# EAGLE design calculator (EAGLE 9.6.2)
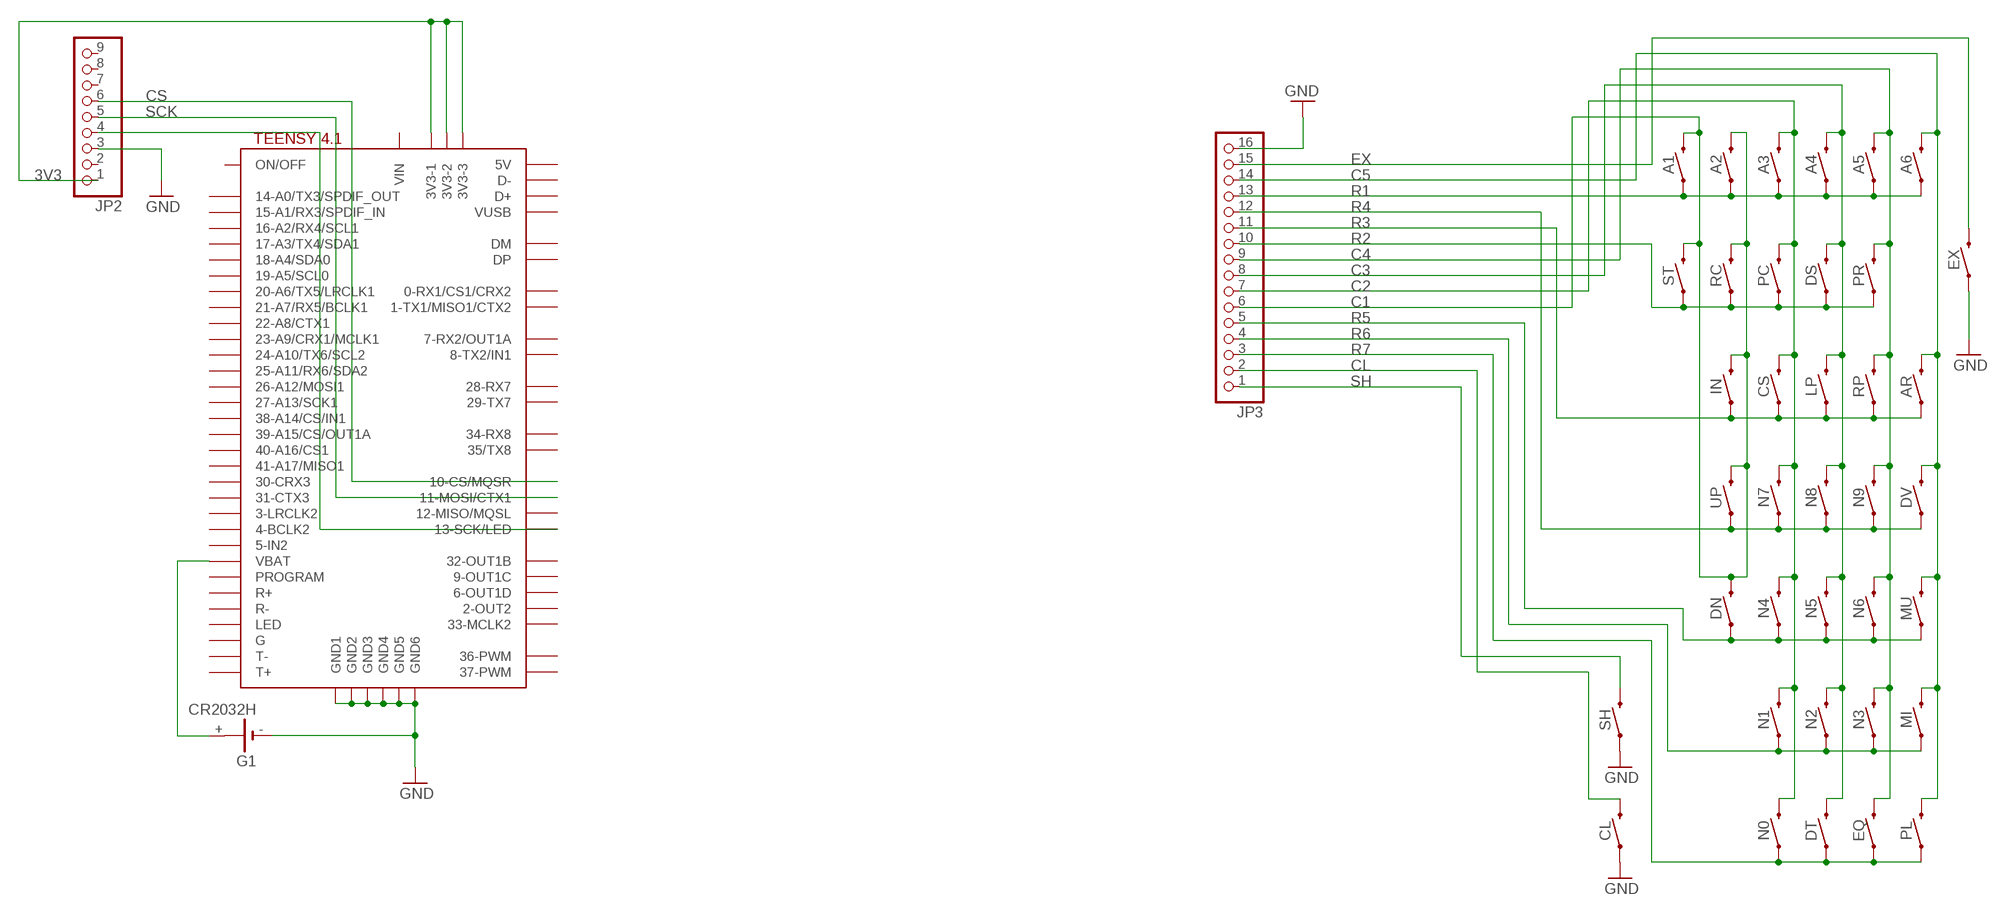
[diagram p0: schematic, sheet 1]

## Parts
A1  MOMENTARY-SWITCH-SPST-PTH-6.0MM  [TACTILE_SWITCH_PTH_6.0MM]
A2  MOMENTARY-SWITCH-SPST-PTH-6.0MM  [TACTILE_SWITCH_PTH_6.0MM]
A3  MOMENTARY-SWITCH-SPST-PTH-6.0MM  [TACTILE_SWITCH_PTH_6.0MM]
A4  MOMENTARY-SWITCH-SPST-PTH-6.0MM  [TACTILE_SWITCH_PTH_6.0MM]
A5  MOMENTARY-SWITCH-SPST-PTH-6.0MM  [TACTILE_SWITCH_PTH_6.0MM]
A6  MOMENTARY-SWITCH-SPST-PTH-6.0MM  [TACTILE_SWITCH_PTH_6.0MM]
AR  MOMENTARY-SWITCH-SPST-PTH-6.0MM  [TACTILE_SWITCH_PTH_6.0MM]
CL  MOMENTARY-SWITCH-SPST-PTH-6.0MM  [TACTILE_SWITCH_PTH_6.0MM]
CS  MOMENTARY-SWITCH-SPST-PTH-6.0MM  [TACTILE_SWITCH_PTH_6.0MM]
DN  MOMENTARY-SWITCH-SPST-PTH-6.0MM  [TACTILE_SWITCH_PTH_6.0MM]
DS  MOMENTARY-SWITCH-SPST-PTH-6.0MM  [TACTILE_SWITCH_PTH_6.0MM]
DT  MOMENTARY-SWITCH-SPST-PTH-6.0MM  [TACTILE_SWITCH_PTH_6.0MM]
DV  MOMENTARY-SWITCH-SPST-PTH-6.0MM  [TACTILE_SWITCH_PTH_6.0MM]
EQ  MOMENTARY-SWITCH-SPST-PTH-6.0MM  [TACTILE_SWITCH_PTH_6.0MM]
EX  MOMENTARY-SWITCH-SPST-PTH-6.0MM  [TACTILE_SWITCH_PTH_6.0MM]
G1  CR2032H  [CR2032H]
IN  MOMENTARY-SWITCH-SPST-PTH-6.0MM  [TACTILE_SWITCH_PTH_6.0MM]
JP2  PINHD-1X9  [1X09-BIG]
JP3  PINHD-1X16  [1X16]
LP  MOMENTARY-SWITCH-SPST-PTH-6.0MM  [TACTILE_SWITCH_PTH_6.0MM]
MI  MOMENTARY-SWITCH-SPST-PTH-6.0MM  [TACTILE_SWITCH_PTH_6.0MM]
MU  MOMENTARY-SWITCH-SPST-PTH-6.0MM  [TACTILE_SWITCH_PTH_6.0MM]
N0  MOMENTARY-SWITCH-SPST-PTH-6.0MM  [TACTILE_SWITCH_PTH_6.0MM]
N1  MOMENTARY-SWITCH-SPST-PTH-6.0MM  [TACTILE_SWITCH_PTH_6.0MM]
N2  MOMENTARY-SWITCH-SPST-PTH-6.0MM  [TACTILE_SWITCH_PTH_6.0MM]
N3  MOMENTARY-SWITCH-SPST-PTH-6.0MM  [TACTILE_SWITCH_PTH_6.0MM]
N4  MOMENTARY-SWITCH-SPST-PTH-6.0MM  [TACTILE_SWITCH_PTH_6.0MM]
N5  MOMENTARY-SWITCH-SPST-PTH-6.0MM  [TACTILE_SWITCH_PTH_6.0MM]
N6  MOMENTARY-SWITCH-SPST-PTH-6.0MM  [TACTILE_SWITCH_PTH_6.0MM]
N7  MOMENTARY-SWITCH-SPST-PTH-6.0MM  [TACTILE_SWITCH_PTH_6.0MM]
N8  MOMENTARY-SWITCH-SPST-PTH-6.0MM  [TACTILE_SWITCH_PTH_6.0MM]
N9  MOMENTARY-SWITCH-SPST-PTH-6.0MM  [TACTILE_SWITCH_PTH_6.0MM]
PC  MOMENTARY-SWITCH-SPST-PTH-6.0MM  [TACTILE_SWITCH_PTH_6.0MM]
PL  MOMENTARY-SWITCH-SPST-PTH-6.0MM  [TACTILE_SWITCH_PTH_6.0MM]
PR  MOMENTARY-SWITCH-SPST-PTH-6.0MM  [TACTILE_SWITCH_PTH_6.0MM]
RC  MOMENTARY-SWITCH-SPST-PTH-6.0MM  [TACTILE_SWITCH_PTH_6.0MM]
RP  MOMENTARY-SWITCH-SPST-PTH-6.0MM  [TACTILE_SWITCH_PTH_6.0MM]
SH  MOMENTARY-SWITCH-SPST-PTH-6.0MM  [TACTILE_SWITCH_PTH_6.0MM]
ST  MOMENTARY-SWITCH-SPST-PTH-6.0MM  [TACTILE_SWITCH_PTH_6.0MM]
U$1  TEENSY41  [TEENSY41]
UP  MOMENTARY-SWITCH-SPST-PTH-6.0MM  [TACTILE_SWITCH_PTH_6.0MM]

## Nets
3V3: JP2.1 U$1.3V3-1 U$1.3V3-2 U$1.3V3-3
C1: A1.3 A2.3 DN.3 IN.3 JP3.6 RC.3 ST.3 UP.3
C2: A3.3 CS.3 JP3.7 N0.3 N1.3 N4.3 N7.3 PC.3
C3: A4.3 DS.3 DT.3 JP3.8 LP.3 N2.3 N5.3 N8.3
C4: A5.3 EQ.3 JP3.9 N3.3 N6.3 N9.3 PR.3 RP.3
C5: A6.3 AR.3 DV.3 JP3.14 MI.3 MU.3 PL.3
CL: CL.3 JP3.2
CS: JP2.6 U$1.10-CS\MQSR(10-CS/MQSR)
EX: EX.3 JP3.15
GND: CL.1 EX.1 G1.- JP2.3 JP3.16 SH.1 U$1.GND1 U$1.GND2 U$1.GND3 U$1.GND4 U$1.GND5 U$1.GND6
MOSI: JP2.5 U$1.11-MOSI/CTX1
N$2: G1.+ U$1.VBAT
R1: A1.1 A2.1 A3.1 A4.1 A5.1 A6.1 JP3.13
R2: DS.1 JP3.10 PC.1 PR.1 RC.1 ST.1
R3: AR.1 CS.1 IN.1 JP3.11 LP.1 RP.1
R4: DV.1 JP3.12 N7.1 N8.1 N9.1 UP.1
R5: DN.1 JP3.5 MU.1 N4.1 N5.1 N6.1
R6: JP3.4 MI.1 N1.1 N2.1 N3.1
R7: DT.1 EQ.1 JP3.3 N0.1 PL.1
SCK: JP2.4 U$1.13-SCK/LED
SH: JP3.1 SH.3
Unconnected: G1.+@1(+) JP2.2 JP2.7 JP2.8 JP2.9 U$1.0-RX1/CS1/CRX2 U$1.1-TX1/MISO1/CTX2 U$1.2-OUT2 U$1.3-LRCLK2 U$1.4-BCLK2 U$1.5-IN2 U$1.6-OUT1D U$1.7-RX2/OUT1A U$1.8-TX2/IN2(8-TX2/IN1) U$1.9-OUT1C U$1.12-MISO/MQSL U$1.14-A0/TX3/SPDIF_OUT U$1.15-A1/RX3/SPDIF_IN U$1.16-A2/RX4/SCL1 U$1.17-A3/TX4/SDA1 U$1.18-A4/SDA0 U$1.19-A5/SCL0 U$1.20-A6/TX5/LRCLK1 U$1.21-A7/RX5/BCLK1 U$1.22-A8/CTX1 U$1.23-A9/CRX1/MCLK1 U$1.24-A10/TX6/SCL2 U$1.25-A11/RX6/SDA2 U$1.26-A12/MOSI1 U$1.27-A13/SCK1 U$1.28-RX7 U$1.29-TX7 U$1.30-CRX3 U$1.31-CTX3 U$1.32-OUT1B U$1.33-MCLK2 U$1.34-RX8 U$1.35-TX8(35/TX8) U$1.36-PWM U$1.37-PWM U$1.38-A14/CS/IN1 U$1.39-A15/CS/OUT1A U$1.40-A16/CS1 U$1.41-A17/MISO1 U$1.+5V(5V) U$1.D+ U$1.D- U$1.DM U$1.DP U$1.G U$1.LED U$1.ON/OFF U$1.PROGRAM U$1.R+ U$1.R- U$1.T+ U$1.T- U$1.VIN U$1.VUSB

## Library data of the parts
A1-A6 AR CL CS DN DS DT DV EQ EX IN LP MI MU N0 N1-N9 PC PL PR RC RP SH ST UP = SparkFun-Switches:MOMENTARY-SWITCH-SPST: Momentary Switch (Pushbutton) - SPST Normally-open (NO) SPST momentary switches (buttons, pushbuttons). Variants PTH-12MM - 12mm square, through-hole Momentary Pushbutton Switch - 12mm Square <https://www.sparkfun.com/products/9190> (COM-09190) PTH-6.0MM, PTH-6.0MM-KIT - 6.0mm square, through-hole Mini Pushbutton Switch <https://www.sparkfun.com/products/97> (COM-00097) KIT package intended for soldering kit's - only one side of pads' copper is exposed. PTH-RIGHT-ANGLE-KIT - Right-angle, through-hole Right Angle Tactile Button <https://www.sparkfun.com/products/10791> - Used on SparkFun BigTime Watch Kit <https://www.sparkfun.com/products/11734> SMD-12MM - 12mm square, surface-mount Tactile Button - SMD (12mm) <https://www.sparkfun.com/products/12993> (COM-12993) Used on SparkFun PicoBoard <https://www.sparkfun.com/products/11888> SMD-4.5MM - 4.5mm Square Trackball Switch Used on SparkFun Blackberry Trackballer Breakout <https://www.sparkfun.com/products/13169> SMD-4.6MMX2.8MM - 4.60mm x 2.80mm, surface mount Used on SparkFun SAMD21 Mini Breakout <https://www.sparkfun.com/products/13664> SMD-5.2MM, SMD-5.2-REDUNDANT - 5.2mm square, surface-mount Mini Pushbutton Switch - SMD <https://www.sparkfun.com/products/8720> (COM-08720) Used on Arduino Pro Mini <https://www.sparkfun.com/products/11114> REDUNDANT package connects both switch circuits together SMD-6.0X3.5MM - 6.0 x 3.5mm, surface mount Momentary Reset Switch SMD <https://www.sparkfun.com/products/8229> (COM-08229) SMD-6.2MM-TALL - 6.2mm square, surface mount Tactile Button - SMD (6mm) <https://www.sparkfun.com/products/12992> Used on SparkFun Digital Sandbox <https://www.sparkfun.com/products/12651> SMD-RIGHT-ANGLE - Right-angle, surface mount Used on SparkFun Block for Intel® Edison - Arduino <https://www.sparkfun.com/products/13036>; PROD_ID: SWCH-08441; SF_SKU: COM-00097
G1 = battery:CR2032H: LI BATTERY Varta
JP2 = adafruit:PINHD-1X9: Pin header 1x10 0.1" spacing With round pins
JP3 = pinhead:PINHD-1X16: PIN HEADER
U$1 = teensy:TEENSY41

## Board
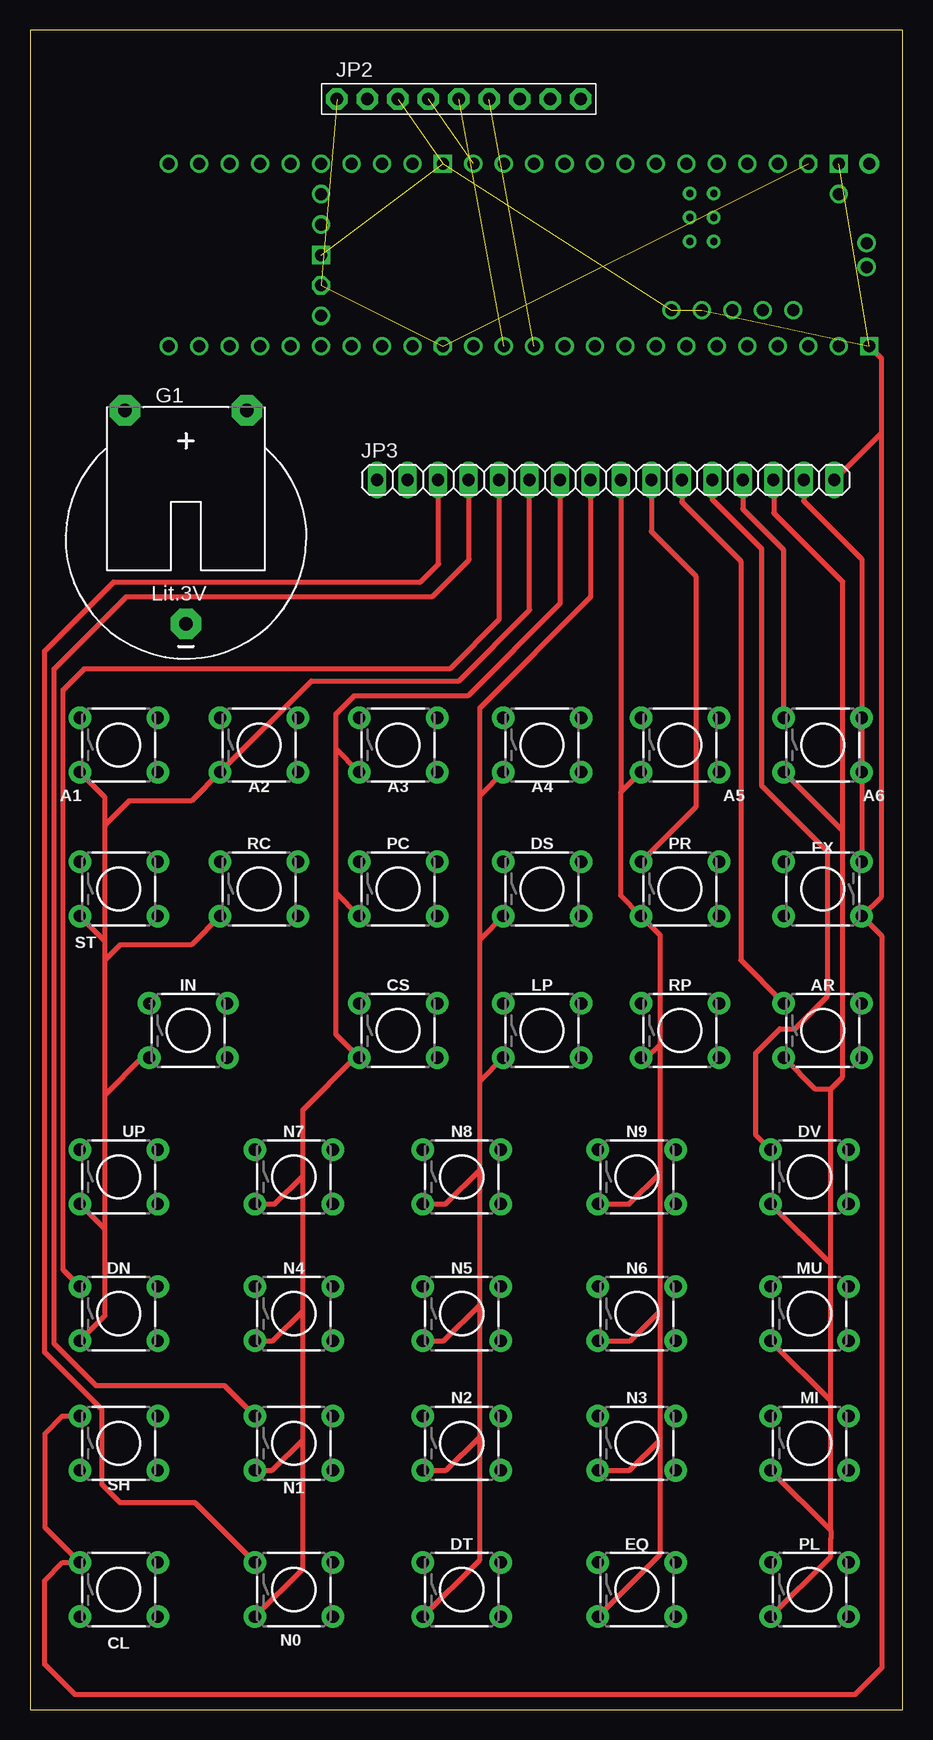
[diagram p1: board, top side]
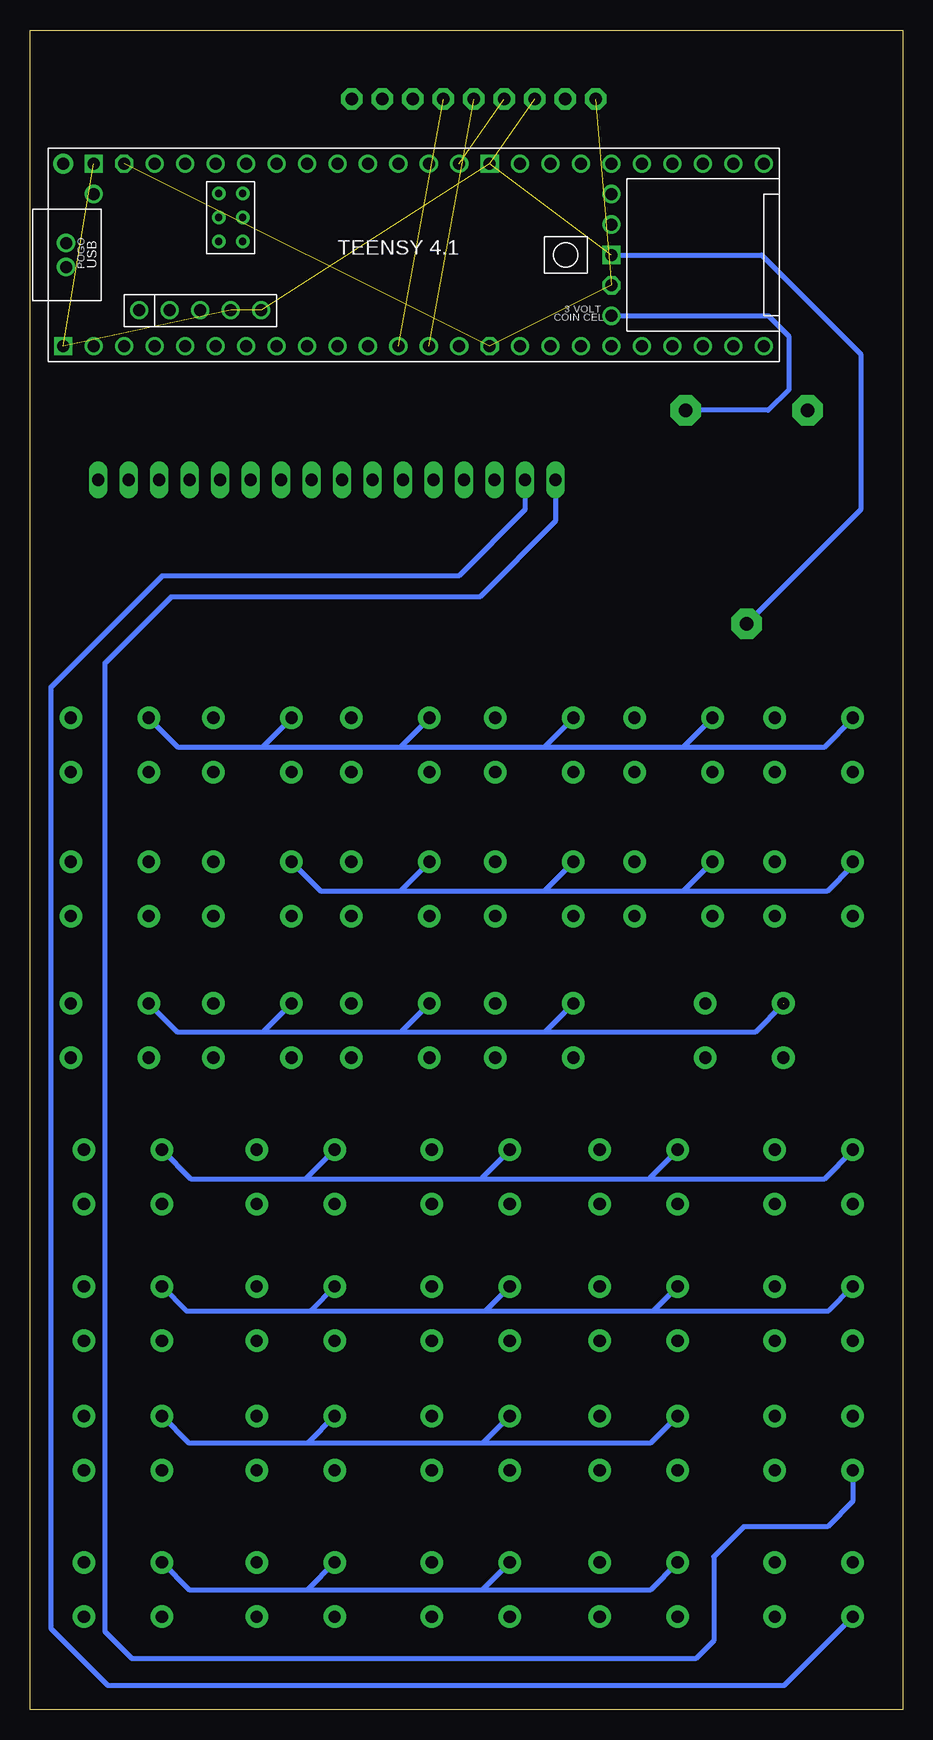
[diagram p2: board, bottom side, seen from below]

Size 72.75 x 140 mm. Coordinates in mm from the lower left corner, seen from the top.
Outline: 0,0 72.75,0 72.75,140 0,140 0,0
Copper layers (1*16): Top 0.035mm / dielectric 1.5mm / Bottom 0.035mm
Design rules "default": minimum track width 6mil, minimum drill 0.35mm, track to track 6mil, track to pad 6mil, pad to pad 6mil, via to via 6mil, smd to smd 6mil, copper to edge 40mil, drill to drill 6mil, minimum pad ring 10mil, minimum via ring 8mil, stop-mask expansion 4mil, vias tented up to drill 0mil, thermal gap 10mil

### Footprints (pad centres in the part's own frame; a part is rotated, then mirrored left to right if it is on the bottom)
TACTILE_SWITCH_PTH_6.0MM = drill 1.016 pad 1.88: 1 -3.251,2.261; 2 3.251,2.261; 3 -3.251,-2.261; 4 3.251,-2.261
CR2032H = drill 1.118 pad 2.54 octagon: + 5.08,10.795; +@1 -5.08,10.795; - 0,-6.985
1X09-BIG = drill 1.016 pad 1.778 octagon: 1 -10.16,0; 2 -7.62,0; 3 -5.08,0; 4 -2.54,0; 5 0,0; 6 2.54,0; 7 5.08,0; 8 7.62,0; 9 10.16,0
1X16 = drill 1.016 long: 1 -19.05,0; 2 -16.51,0; 3 -13.97,0; 4 -11.43,0; 5 -8.89,0; 6 -6.35,0; 7 -3.81,0; 8 -1.27,0; 9 1.27,0; 10 3.81,0; 11 6.35,0; 12 8.89,0; 13 11.43,0; 14 13.97,0; 15 16.51,0; 16 19.05,0
TEENSY41 = drill 1: 0-RX1/CS1/CRX2 -27.94,-7.62; 1-TX1/MISO1/CTX2 -25.4,-7.62; 2-OUT2 -22.86,-7.62; 3-LRCLK2 -20.32,-7.62; 4-BCLK2 -17.78,-7.62; 5-IN2 -15.24,-7.62; 6-OUT1D -12.7,-7.62; 7-RX2/OUT1A -10.16,-7.62; 8-TX2/IN2 -7.62,-7.62; 9-OUT1C -5.08,-7.62; 10-CS\MQSR -2.54,-7.62; 11-MOSI/CTX1 0,-7.62; 12-MISO/MQSL 2.54,-7.62; 13-SCK/LED 2.54,7.62; 14-A0/TX3/SPDIF_OUT 0,7.62; 15-A1/RX3/SPDIF_IN -2.54,7.62; 16-A2/RX4/SCL1 -5.08,7.62; 17-A3/TX4/SDA1 -7.62,7.62; 18-A4/SDA0 -10.16,7.62; 19-A5/SCL0 -12.7,7.62; 20-A6/TX5/LRCLK1 -15.24,7.62; 21-A7/RX5/BCLK1 -17.78,7.62; 22-A8/CTX1 -20.32,7.62; 23-A9/CRX1/MCLK1 -22.86,7.62; 24-A10/TX6/SCL2 7.62,-7.62; 25-A11/RX6/SDA2 10.16,-7.62; 26-A12/MOSI1 12.7,-7.62; 27-A13/SCK1 15.24,-7.62; 28-RX7 17.78,-7.62; 29-TX7 20.32,-7.62; 30-CRX3 22.86,-7.62; 31-CTX3 25.4,-7.62; 32-OUT1B 27.94,-7.62; 33-MCLK2 27.94,7.62; 34-RX8 25.4,7.62; 35-TX8 22.86,7.62; 36-PWM 20.32,7.62; 37-PWM 17.78,7.62; 38-A14/CS/IN1 15.24,7.62; 39-A15/CS/OUT1A 12.7,7.62; 40-A16/CS1 10.16,7.62; 41-A17/MISO1 7.62,7.62; +5V -24.13,-4.62; D+ -30.25,-1; D- -30.25,1; DM -21.59,-4.62; DP -19.05,-4.62; GND4 -16.51,-4.62; GND5 -13.97,-4.62; ON/OFF 15.24,5.08; PROGRAM 15.24,2.54; VBAT 15.24,-5.08; VUSB -27.94,5.08 | drill 1 octagon: 3V3-1 5.08,-7.62; 3V3-2 15.24,-2.54; 3V3-3 -25.4,7.62 | drill 0.6: G -15.51,3.12; LED -17.51,3.12; R+ -17.51,5.12; R- -15.51,5.12; T+ -15.51,1.12; T- -17.51,1.12 | drill 1 square: GND1 -30.48,-7.62; GND2 15.24,0; GND3 5.08,7.62; GND6 -27.94,7.62 | drill 1 pad 1.676: VIN -30.48,7.62

### Placement (x,y rotation side)
A1  7.4,80.4 0 top
A2  19.1,80.4 0 top
A3  30.7,80.4 0 top
A4  42.7,80.4 0 top
A5  54.2,80.4 0 top
A6  66.1,80.4 0 top
AR  66.1,56.6 0 top
CL  7.4,10 0 top
CS  30.7,56.6 0 top
DN  7.4,33 0 top
DS  42.7,68.4 0 top
DT  36,10 0 top
DV  65,44.4 0 top
EQ  50.6,10 0 top
EX  66.1,68.4 180 top
G1  13,97.5 0 top
IN  13.19,56.6 0 top
JP2  35.75,134.25 0 top
JP3  48,102.5 0 top
LP  42.7,56.6 0 top
MI  65,22.2 0 top
MU  65,33 0 top
N0  22,10 0 top
N1  22,22.2 0 top
N2  36,22.2 0 top
N3  50.6,22.2 0 top
N4  22,33 0 top
N5  36,33 0 top
N6  50.6,33 0 top
N7  22,44.4 0 top
N8  36,44.4 0 top
N9  50.6,44.4 0 top
PC  30.7,68.4 0 top
PL  65,10 0 top
PR  54.2,68.4 0 top
RC  19.1,68.4 0 top
RP  54.2,56.6 0 top
SH  7.4,22.2 0 top
ST  7.4,68.4 0 top
U$1  39.5,121.25 0 bottom
UP  7.4,44.4 0 top

### Tracks (layer width: path | path; a pad name or v marks a point on that pad's centre or on a via)
3V3  (3 unrouted)
C1
  Top 0.406: DN.3 6.25,32.84 6.25,40.04 | A1.3 6.25,76.04 6.25,73.75 | 6.25,40.04 6.25,51.25 | 6.25,51.25 6.25,62.5 | 6.25,62.5 6.25,64.04 | 6.25,64.04 6.25,73.75 | UP.3 6.25,40.04 | ST.3 6.25,64.04 | 6.25,51.25 9.34,54.34 IN.3 | RC.3 13.46,63.75 7.5,63.75 6.25,62.5 | 6.25,73.75 8.25,75.75 13.46,75.75 A2.3 23.46,85.75 35.75,85.75 41.65,91.65 JP3.6
C2
  Top 0.406: N0.3 22.75,11.74 22.75,22.5 | 22.75,22.5 22.75,33.25 | 22.75,33.25 22.75,44.5 | 22.75,44.5 22.75,50 27.09,54.34 CS.3 25.5,56.29 25.5,68.09 | N1.3 20.19,19.94 22.75,22.5 | N4.3 20.24,30.74 22.75,33.25 | N7.3 20.39,42.14 22.75,44.5 | 25.5,68.09 25.5,80.09 | 25.5,80.09 25.5,83 27,84.5 36.5,84.5 44.19,92.19 JP3.7 | PC.3 25.5,68.09 | A3.3 25.5,80.09
C3
  Top 0.406: DT.3 37.5,12.49 37.5,22.75 | LP.3 37.5,52.39 | 37.5,22.75 37.5,33.75 | 37.5,33.75 37.5,45 | 37.5,45 37.5,52.39 | N2.3 34.69,19.94 37.5,22.75 | N5.3 34.49,30.74 37.5,33.75 | N8.3 34.64,42.14 37.5,45 | 37.5,52.39 37.5,64.19 | 37.5,64.19 37.5,76.19 | 37.5,76.19 37.5,83.5 46.73,92.73 JP3.8 | DS.3 37.5,64.19 | A4.3 37.5,76.19
C4
  Top 0.406: EQ.3 52.56,12.95 52.56,22.5 | 52.56,22.5 52.56,33.25 | 52.56,33.25 52.56,44.75 | 52.56,44.75 52.56,55.5 | 52.56,55.5 52.56,64.53 PR.3 49.25,67.84 49.25,76.44 49.27,76.46 | N3.3 49.99,19.94 52.56,22.5 | N6.3 50.05,30.74 52.56,33.25 | N9.3 49.95,42.14 52.56,44.75 | RP.3 51.4,54.34 52.56,55.5 | A5.3 49.27,76.46 | JP3.9 49.27,76.46
C5
  Top 0.406: PL.3 66.75,12.74 66.75,14.25 66.75,14.94 | 66.75,14.94 66.75,25.74 | 66.75,25.74 66.75,37.14 | 66.75,37.14 66.75,51.75 | 66.75,51.75 67.75,52.75 67.75,73.24 | 67.75,73.24 67.75,94 62,99.75 62,102.47 JP3.14 | A6.3 67.75,73.24 | AR.3 65.44,51.75 66.75,51.75 | DV.3 66.75,37.14 | MU.3 66.75,25.74 | MI.3 66.75,14.94
CL
  Bottom 0.406: CL.3 9.89,2 66.25,2 71,6.75 71,85.25 61.75,94.5 37,94.5 31.49,100.01 JP3.2
CS  (1 unrouted)
EX
  Top 0.406: JP3.15 64.51,100.74 69.35,95.9 EX.3
GND  (6 unrouted)
  Top 0.406: SH.1 2.71,24.46 1.25,23 1.25,15.16 CL.1 2.73,12.26 1.22,10.75 1.22,3.78 3.75,1.25 68.78,1.25 71.03,3.5 71.03,64.46 EX.1 71,67.79 71,106.45 | U$1.GND1 71,112.61 71,106.45 | JP3.16 71,106.45
  Bottom 0.406: U$1.GND2 11.75,121.25 3.5,113 3.5,100.02 G1.-
MOSI  (1 unrouted)
N$2
  Bottom 0.406: U$1.VBAT 11.17,116.17 9.5,114.5 9.5,110 11.21,108.3 G1.+
R1
  Top 0.406: A6.1 62.85,96.65 61.38,98.12 61.25,98.25 59.43,100.07 JP3.13
  Bottom 0.406: A6.1 60.44,80.25 53.36,80.25 | 53.36,80.25 41.86,80.25 | 41.86,80.25 29.86,80.25 | 29.86,80.25 18.26,80.25 | 18.26,80.25 6.5,80.25 4.15,82.6 A1.1 | A2.1 18.26,80.25 | A3.1 29.86,80.25 | A4.1 41.86,80.25 | A5.1 53.36,80.25
R2
  Top 0.406: PR.1 55.5,75.21 55.5,94.5 51.81,98.19 JP3.10
  Bottom 0.406: PR.1 48.54,68.25 41.86,68.25 | 41.86,68.25 29.86,68.25 | 29.86,68.25 18.26,68.25 | 18.26,68.25 6.25,68.25 4.15,70.35 ST.1 | RC.1 18.26,68.25 | PC.1 29.86,68.25 | DS.1 41.86,68.25
R3  (1 unrouted)
  Top 0.406: AR.1 59.25,62.46 59.25,95.75 54.35,100.65 JP3.11
  Bottom 0.406: AR.1 60.49,56.5 53.31,56.5 | 53.31,56.5 41.81,56.5 | 41.81,56.5 29.81,56.5 | 29.81,56.5 12.25,56.5 9.94,58.81 | CS.1 29.81,56.5 | LP.1 41.81,56.5 | RP.1 53.31,56.5
R4
  Top 0.406: DV.1 60.5,47.91 60.5,54.75 62.5,56.75 63.75,56.75 66.5,59.5 66.5,71.5 61,77 61,96.75 56.89,100.86 JP3.12
  Bottom 0.406: DV.1 59.34,44.25 49.75,44.25 | 49.75,44.25 35,44.25 | 35,44.25 21,44.25 | 21,44.25 6.5,44.25 4.15,46.6 UP.1 | N9.1 49.75,44.26 49.75,44.25 | N8.1 35,44.41 35,44.25 | N7.1 21,44.41 21,44.25
R5
  Top 0.406: DN.1 2.75,36.66 2.75,85 4.5,86.75 35,86.75 39.11,90.86 JP3.5
  Bottom 0.406: MU.1 59.74,33.25 49.36,33.25 | 20.76,33.25 N4.1 | 49.36,33.25 34.76,33.25 | 34.76,33.25 20.76,33.25 | 20.76,33.25 6.16,33.25 DN.1 | N5.1 34.76,33.25 | N6.1 49.36,33.25
R6
  Top 0.406: N1.1 16.21,27 5.5,27 2,30.5 2,86.75 8,92.75 33.5,92.75 36.5,95.75 36.57,95.82 | 36.61,95.86 36.57,95.82 | JP3.4 36.57,95.82
  Bottom 0.406: MI.1 59.54,22.25 49.56,22.25 | N1.1 20.96,22.25 34.96,22.25 | 49.56,22.25 34.96,22.25 | N2.1 34.96,22.25 | N3.1 49.56,22.25
R7
  Top 0.406: N0.1 13.76,17.25 7.5,17.25 6,18.75 6,25 1.22,29.78 1.22,88.25 6.97,94 32.57,94 34.07,95.5 34.03,95.54 JP3.3
  Bottom 0.406: PL.1 59.49,10 49.61,10 | 49.61,10 35.01,10 | 35.01,10 21,10 N0.1 | DT.1 35.01,10 | EQ.1 49.61,10
SCK  (1 unrouted)
SH
  Bottom 0.406: SH.3 4.15,17.35 6.25,15.25 13.25,15.25 15.75,12.75 15.75,5.75 17.25,4.25 64.25,4.25 66.5,6.5 66.5,87.25 61,92.75 35.25,92.75 28.95,99.05 JP3.1